# Altium schematic sheet Section A - Title A.SchDoc
size 299 x 229 mm
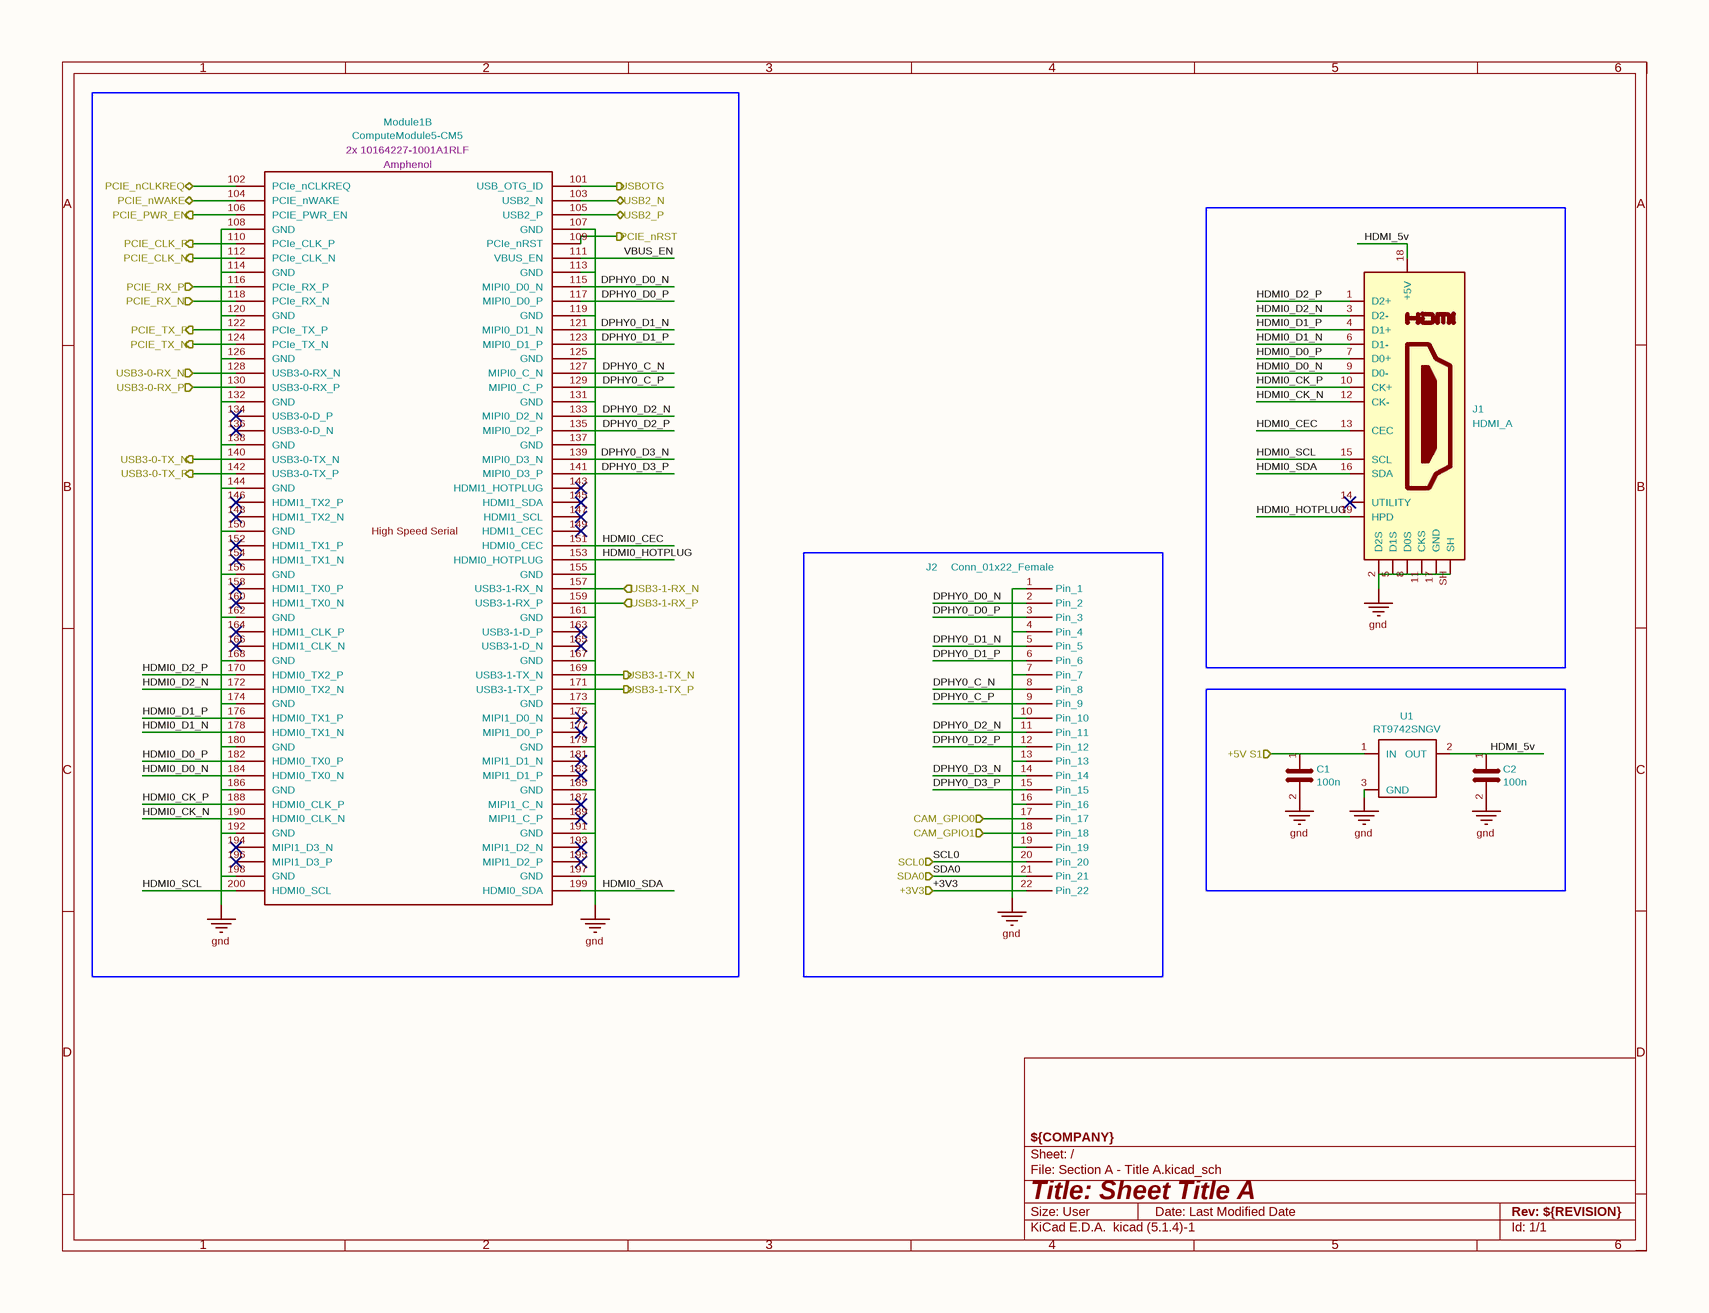
[diagram p0: Section A - Title A.SchDoc]

## Parts
C1  100n  [C_0603_1608Metric]
C2  100n  [C_0603_1608Metric]
J1  HDMI_A  [AMPHENOL_10029449-111RLF]
J2  Conn_01x22_Female  [Hirose_FH12-22S-0.5SH_1x22-1MP_P0.50mm_Horizontal]
Module1  Field4: Amphenol  Field5: 2x 10164227-1001A1RLF  [Raspberry-Pi-5-Compute-Module]  (hidden comment: ComputeModule5-CM5)  (part B of 2)
U1  RT9742SNGV  [TSOT-23_HandSoldering]

## Ports
+3V3 (in), +5V S1 (in), CAM_GPIO0 (in), CAM_GPIO1 (in), PCIE_CLK_N (out), PCIE_CLK_P (out), PCIE_nCLKREQ (bidir), PCIE_nRST (out), PCIE_nWAKE (bidir), PCIE_PWR_EN (out), PCIE_RX_N (in), PCIE_RX_P (in), PCIE_TX_N (out), PCIE_TX_P (out), SCL0 (in), SDA0 (in), USB2_N (bidir), USB2_P (bidir), USB3-0-RX_N (in), USB3-0-RX_P (in), USB3-0-TX_N (out), USB3-0-TX_P (out), USB3-1-RX_N (in), USB3-1-RX_P (in), USB3-1-TX_N (out), USB3-1-TX_P (out), USBOTG (out)

## Nets
gnd: C1.2 C2.2 J1.2(D2S) J1.5(D1S) J1.8(D0S) J1.11(CKS) J1.17(GND) J1.SH J2.1(Pin_1) J2.4(Pin_4) J2.7(Pin_7) J2.10(Pin_10) J2.13(Pin_13) J2.16(Pin_16) J2.19(Pin_19) Module1.107(GND) Module1.108(GND) Module1.113(GND) Module1.114(GND) Module1.119(GND) Module1.120(GND) Module1.125(GND) Module1.126(GND) Module1.131(GND) Module1.132(GND) Module1.137(GND) Module1.138(GND) Module1.144(GND) Module1.150(GND) Module1.155(GND) Module1.156(GND) Module1.161(GND) Module1.162(GND) Module1.167(GND) Module1.168(GND) Module1.173(GND) Module1.174(GND) Module1.179(GND) Module1.180(GND) Module1.185(GND) Module1.186(GND) Module1.191(GND) Module1.192(GND) Module1.197(GND) Module1.198(GND) U1.3(GND)
+3V3: J2.22(Pin_22) ; port +3V3
+5V S1: C1.1 U1.1(IN) ; port +5V S1
CAM_GPIO0: J2.17(Pin_17) ; port CAM_GPIO0
CAM_GPIO1: J2.18(Pin_18) ; port CAM_GPIO1
DPHY0_C_N: J2.8(Pin_8) Module1.127(MIPI0_C_N)
DPHY0_C_P: J2.9(Pin_9) Module1.129(MIPI0_C_P)
DPHY0_D0_N: J2.2(Pin_2) Module1.115(MIPI0_D0_N)
DPHY0_D0_P: J2.3(Pin_3) Module1.117(MIPI0_D0_P)
DPHY0_D1_N: J2.5(Pin_5) Module1.121(MIPI0_D1_N)
DPHY0_D1_P: J2.6(Pin_6) Module1.123(MIPI0_D1_P)
DPHY0_D2_N: J2.11(Pin_11) Module1.133(MIPI0_D2_N)
DPHY0_D2_P: J2.12(Pin_12) Module1.135(MIPI0_D2_P)
DPHY0_D3_N: J2.14(Pin_14) Module1.139(MIPI0_D3_N)
DPHY0_D3_P: J2.15(Pin_15) Module1.141(MIPI0_D3_P)
HDMI0_CEC: J1.13(CEC) Module1.151(HDMI0_CEC)
HDMI0_CK_N: J1.12(CK-) Module1.190(HDMI0_CLK_N)
HDMI0_CK_P: J1.10(CK+) Module1.188(HDMI0_CLK_P)
HDMI0_D0_N: J1.9(D0-) Module1.184(HDMI0_TX0_N)
HDMI0_D0_P: J1.7(D0+) Module1.182(HDMI0_TX0_P)
HDMI0_D1_N: J1.6(D1-) Module1.178(HDMI0_TX1_N)
HDMI0_D1_P: J1.4(D1+) Module1.176(HDMI0_TX1_P)
HDMI0_D2_N: J1.3(D2-) Module1.172(HDMI0_TX2_N)
HDMI0_D2_P: J1.1(D2+) Module1.170(HDMI0_TX2_P)
HDMI0_HOTPLUG: J1.19(HPD) Module1.153(HDMI0_HOTPLUG)
HDMI0_SCL: J1.15(SCL) Module1.200(HDMI0_SCL)
HDMI0_SDA: J1.16(SDA) Module1.199(HDMI0_SDA)
HDMI_5v: C2.1 J1.18(+5V) U1.2(OUT)
PCIE_CLK_N: Module1.112(PCIe_CLK_N) ; port PCIE_CLK_N
PCIE_CLK_P: Module1.110(PCIe_CLK_P) ; port PCIE_CLK_P
PCIE_nCLKREQ: Module1.102(PCIe_nCLKREQ) ; port PCIE_nCLKREQ
PCIE_nRST: Module1.109(PCIe_nRST) ; port PCIE_nRST
PCIE_nWAKE: Module1.104(PCIE_nWAKE) ; port PCIE_nWAKE
PCIE_PWR_EN: Module1.106(PCIE_PWR_EN) ; port PCIE_PWR_EN
PCIE_RX_N: Module1.118(PCIe_RX_N) ; port PCIE_RX_N
PCIE_RX_P: Module1.116(PCIe_RX_P) ; port PCIE_RX_P
PCIE_TX_N: Module1.124(PCIe_TX_N) ; port PCIE_TX_N
PCIE_TX_P: Module1.122(PCIe_TX_P) ; port PCIE_TX_P
SCL0: J2.20(Pin_20) ; port SCL0
SDA0: J2.21(Pin_21) ; port SDA0
USB2_N: Module1.103(USB2_N) ; port USB2_N
USB2_P: Module1.105(USB2_P) ; port USB2_P
USB3-0-RX_N: Module1.128(USB3-0-RX_N) ; port USB3-0-RX_N
USB3-0-RX_P: Module1.130(USB3-0-RX_P) ; port USB3-0-RX_P
USB3-0-TX_N: Module1.140(USB3-0-TX_N) ; port USB3-0-TX_N
USB3-0-TX_P: Module1.142(USB3-0-TX_P) ; port USB3-0-TX_P
USB3-1-RX_N: Module1.157(USB3-1-RX_N) ; port USB3-1-RX_N
USB3-1-RX_P: Module1.159(USB3-1-RX_P) ; port USB3-1-RX_P
USB3-1-TX_N: Module1.169(USB3-1-TX_N) ; port USB3-1-TX_N
USB3-1-TX_P: Module1.171(USB3-1-TX_P) ; port USB3-1-TX_P
USBOTG: Module1.101(USB_OTG_ID) ; port USBOTG
VBUS_EN: Module1.111(VBUS_EN)

Not connected (* = marked no-connect by the designer): J1 14(UTILITY)*; Module1 134(USB3-0-D_P)* 136(USB3-0-D_N)* 143(HDMI1_HOTPLUG)* 145(HDMI1_SDA)* 146(HDMI1_TX2_P)* 147(HDMI1_SCL)* 148(HDMI1_TX2_N)* 149(HDMI1_CEC)* 152(HDMI1_TX1_P)* 154(HDMI1_TX1_N)* 158(HDMI1_TX0_P)* 160(HDMI1_TX0_N)* 163(USB3-1-D_P)* 164(HDMI1_CLK_P)* 165(USB3-1-D_N)* 166(HDMI1_CLK_N)* 175(MIPI1_D0_N)* 177(MIPI1_D0_P)* 181(MIPI1_D1_N)* 183(MIPI1_D1_P)* 187(MIPI1_C_N)* 189(MIPI1_C_P)* 193(MIPI1_D2_N)* 194(MIPI1_D3_N)* 195(MIPI1_D2_P)* 196(MIPI1_D3_P)*

## Notes on the sheet
- 1
- 2
- 3
- 4
- 5
- 6
- A
- B
- C
- D
- Title: Sheet Title A
- File: Section A - Title A.kicad_sch
- Sheet: /
- ${COMPANY}
- KiCad E.D.A.  kicad (5.1.4)-1
- Size: User
- Date: Last Modified Date
- Rev: ${REVISION}
- Id: 1/1
- (in symbol ComputeModule5-CM5, part B) High Speed Serial

## Library data of the parts
C1 C2 = C: Part Description: 0.1uF 10% 16V Ceramic Capacitor X7R 0402 (1005 Metric); Field4: Farnell; Field5: 2611911; Field6: RM EMK105 B7104KV-F; Field7: TAIYO YUDEN EUROPE GMBH; Field8: 110091611; Value: 100n; Footprint: Capacitor_SMD:C_0603_1608Metric
J1 = HDMI_A: Description: HDMI type A connector; Value: HDMI_A; Footprint: 10029449-111RLF:AMPHENOL_10029449-111RLF
J2 = Conn_01x22_Socket: Part Description: 22 Position FFC, FPC Connector Contacts, Bottom 0.020" (0.50mm) Surface Mount, Right Angle; Field4: Mouser; Field5: 798-FH12-22S-0.5SH55; Field6: FH12-22S-0.5SH55; Field7: Hirose; Value: Conn_01x22_Female; Footprint: Connector_FFC-FPC:Hirose_FH12-22S-0.5SH_1x22-1MP_P0.50mm_Horizontal
Module1 = ComputeModule5-CM5: Part Description: 100 Position Connector Receptacle, Center Strip Contacts Surface Mount Gold; Description: RaspberryPi Compute module 5; Field7: Hirose; Field6: 2x 10164227-1001A1RLF; Value: ComputeModule5-CM5; Footprint: cm5:Raspberry-Pi-5-Compute-Module
U1 = RT9742SNGV: Part Description: Power Switch/Driver 1:1 N-Channel 500mA SOT-23-3; Field4: Farnell; Field5: 2575555; Field7: RichTek; Field8: USWI00155; Field6: RT9742SNGV; Value: RT9742SNGV; Footprint: Package_TO_SOT_SMD:TSOT-23_HandSoldering